# Altium project LED_Dimmer_MOSFET_SSR.PrjPcb
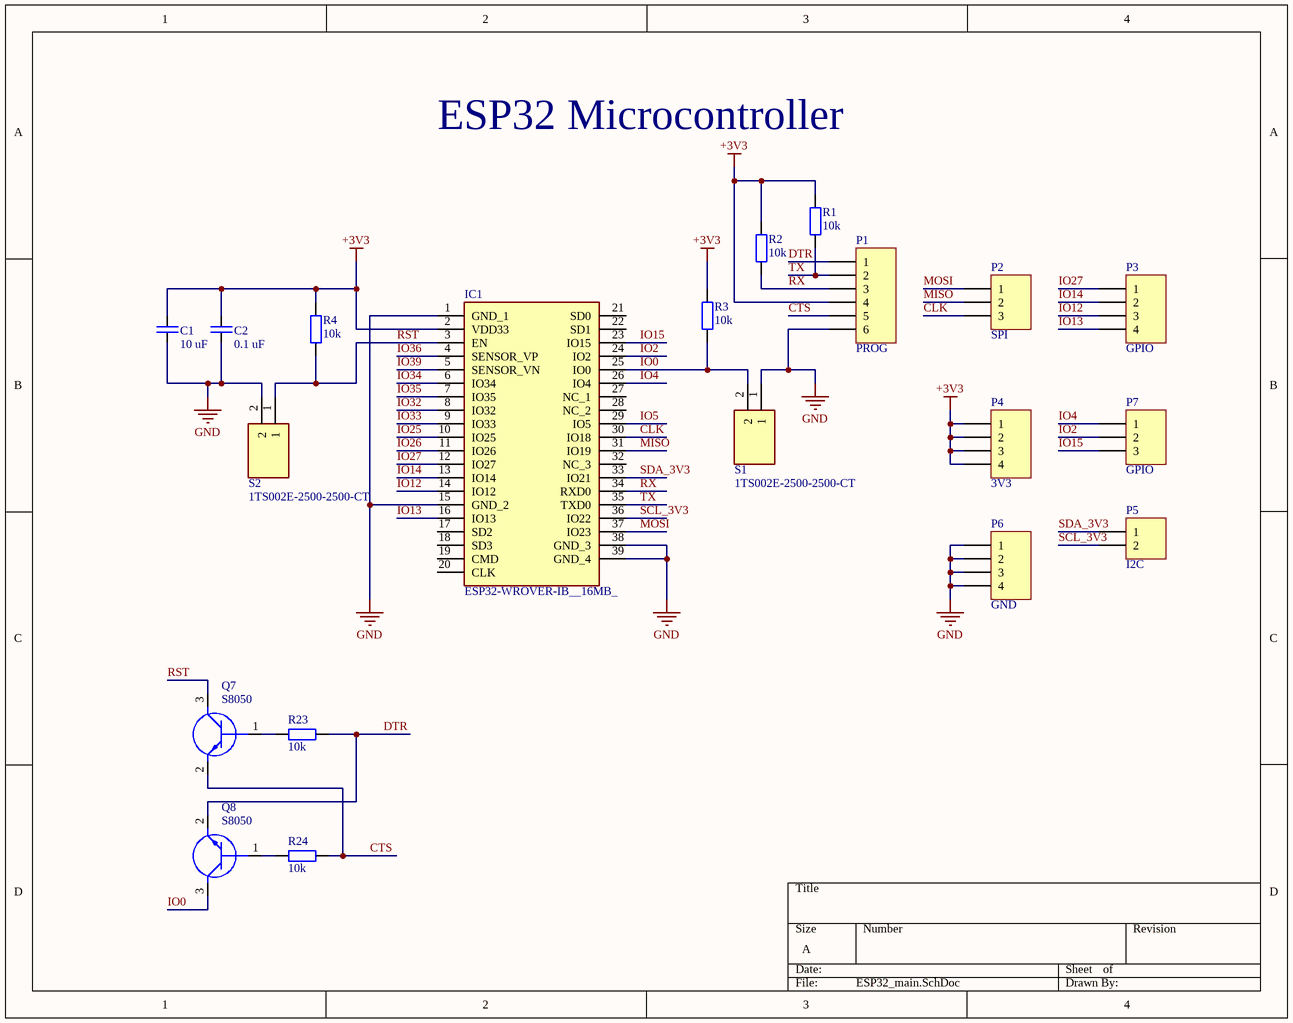
[diagram p0: ESP32_main.SchDoc]
3 sheets, 57 parts. Net scope: global (net labels, ports and power ports of the same name join across sheets).
Board files: LED_Dimmer_MOSFET_SSR_v1.0.PcbDoc, LED_Dimmer_MOSFET_SSR_v1.1.PcbDoc
Sheets:
  ESP32_main.SchDoc
  Mosfet_SSR.SchDoc
  230V_Inputs.SchDoc

## Sheet ESP32_main.SchDoc
size A; SheetNumber: 1; SheetTotal: 3

### Parts
C1  10 uF  [C2012_0805I_N]
C2  0.1 uF  [C2012_0805I_N]
IC1  ESP32-WROVER-IB__16MB_  [ESP32WROVERIB16MB]
P1  PROG  [HDR1X6]
P2  SPI  [HDR1X3]
P3  GPIO  [HDR1X4]
P4  3V3  [HDR1X4]
P5  I2C  [HDR1X2]
P6  GND  [HDR1X4]
P7  GPIO  [HDR1X3]
Q7  S8050  [SOT95P240X110-3N]
Q8  S8050  [SOT95P240X110-3N]
R1  10k  [R2012_0805I_N]
R2  10k  [R2012_0805I_N]
R3  10k  [R2012_0805I_N]
R4  10k  [R2012_0805I_N]
R23  10k  [R2012_0805I_N]
R24  10k  [R2012_0805I_N]
S1  1TS002E-2500-2500-CT  [1TS002E25002500CT]
S2  1TS002E-2500-2500-CT  [1TS002E25002500CT]

### Nets
+3V3: C1.1 C2.1 IC1.2(VDD33) P1.4 P4.1 P4.2 P4.3 P4.4 R1.2 R2.2 R3.2 R4.2
GND: C1.2 C2.2 IC1.1(GND_1) IC1.15(GND_2) IC1.38(GND_3) IC1.39(GND_4) P1.6 P6.1 P6.2 P6.3 P6.4 S1.1 S2.2
CLK: IC1.30(IO18) P2.3
CTS: P1.5 Q7.2(E) R24.1
DTR: P1.1 Q8.2(E) R23.1
IO0: IC1.25(IO0) Q8.3(C) R3.1 S1.2
IO2: IC1.24(IO2) P7.2
IO4: IC1.26(IO4) P7.1
IO5: IC1.29(IO5)
IO12: IC1.14(IO12) P3.3
IO13: IC1.16(IO13) P3.4
IO14: IC1.13(IO14) P3.2
IO15: IC1.23(IO15) P7.3
IO25: IC1.10(IO25)
IO26: IC1.11(IO26)
IO27: IC1.12(IO27) P3.1
IO32: IC1.8(IO32)
IO33: IC1.9(IO33)
IO34: IC1.6(IO34)
IO35: IC1.7(IO35)
IO36: IC1.4(SENSOR_VP)
IO39: IC1.5(SENSOR_VN)
MISO: IC1.31(IO19) P2.2
MOSI: IC1.37(IO23) P2.1
RST: IC1.3(EN) Q7.3(C) R4.1 S2.1
RX: IC1.34(RXD0) P1.3 R2.1
SCL_3V3: IC1.36(IO22) P5.2
SDA_3V3: IC1.33(IO21) P5.1
TX: IC1.35(TXD0) P1.2 R1.1
NetQ7_1: Q7.1(B) R23.2
NetQ8_1: Q8.1(B) R24.2

Not connected (* = marked no-connect by the designer): IC1 17(SD2) 18(SD3) 19(CMD) 20(CLK) 21(SD0) 22(SD1) 27(NC_1) 28(NC_2) 32(NC_3)

### Notes on the sheet
- ESP32 Microcontroller

### Library data of the parts
C1 C2 = C: Capacitor
  C1: Value: 10 uF
  C2: Value: 0.1 uF
IC1 = ESP32-WROVER-IB__16MB_: Integrated Circuit; Manufacturer_Name: Espressif Systems; Manufacturer_Part_Number: ESP32-WROVER-IB (16MB); Datasheet Link: https://componentsearchengine.com/Datasheets/1/ESP32-WROVER-IB (16MB).pdf; Height: 3.4mm; Mouser Part Number: 356-ESP32WROIB(16MB); Mouser Price/Stock: https://www.mouser.co.uk/ProductDetail/Espressif-Systems/ESP32-WROVER-IB-16MB?qs=w%2Fv1CP2dgqoY4iJbr7cDFQ%3D%3D
P1 = Header 6: Header, 6-Pin; LatestRevisionDate: 17-Jul-2002; LatestRevisionNote: Re-released for DXP Platform.; Publisher: Altium Limited
P2 P7 = Header 3: Header, 3-Pin; LatestRevisionDate: 17-Jul-2002; LatestRevisionNote: Re-released for DXP Platform.; Publisher: Altium Limited
P3 P4 P6 = Header 4: Header, 4-Pin; LatestRevisionDate: 17-Jul-2002; LatestRevisionNote: Re-released for DXP Platform.; Publisher: Altium Limited
P5 = Header 2: Header, 2-Pin; LatestRevisionDate: 17-Jul-2002; LatestRevisionNote: Re-released for DXP Platform.; Publisher: Altium Limited
Q7 Q8 = S8050: Transistor BJT NPN; Manufacturer_Name: Galaxy; Manufacturer_Part_Number: S8050G; Height: 1.1mm
R1-R4 R23 R24 = R: Value: 10k
S1 S2 = 1TS002E-2500-2500-CT: Switch; Manufacturer_Name: HON YUAN; Datasheet Link: https://datasheet.lcsc.com/szlcsc/HYP-1TS002E-2500-2500_C329185.pdf; Height: 2.7mm; Manufacturer_Part_Number: 1TS002E-2500-2500-CT

## Sheet Mosfet_SSR.SchDoc
size A; SheetNumber: 2; SheetTotal: 3
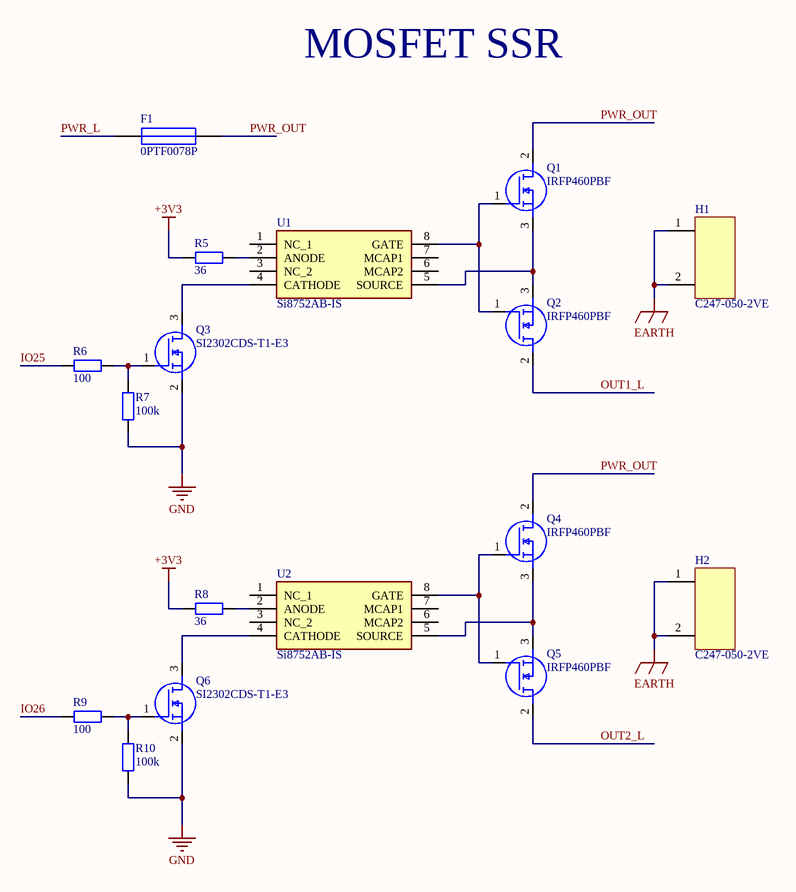
[diagram p1: Mosfet_SSR.SchDoc]

### Parts
F1  0PTF0078P  [FH1-200CK-B]
H1  C247-050-2VE  [C247-050-2VE]
H2  C247-050-2VE  [C247-050-2VE]
Q1  IRFP460PBF  [TO546P531X1558X2511-3P]
Q2  IRFP460PBF  [TO546P531X1558X2511-3P]
Q3  SI2302CDS-T1-E3  [SOT95P237X112-3N]
Q4  IRFP460PBF  [TO546P531X1558X2511-3P]
Q5  IRFP460PBF  [TO546P531X1558X2511-3P]
Q6  SI2302CDS-T1-E3  [SOT95P237X112-3N]
R5  36  [R2012_0805I_N]
R6  100  [R2012_0805I_N]
R7  100k  [R2012_0805I_N]
R8  36  [R2012_0805I_N]
R9  100  [R2012_0805I_N]
R10  100k  [R2012_0805I_N]
U1  Si8752AB-IS  [SOIC127P600X175-8N]
U2  Si8752AB-IS  [SOIC127P600X175-8N]

### Nets
+3V3: R5.2 R8.2
EARTH: H1.1 H1.2 H2.1 H2.2
GND: Q3.2(S) Q6.2(S) R7.1 R10.1
IO25: R6.2
IO26: R9.2
OUT1_L: Q2.2(D)
OUT2_L: Q5.2(D)
PWR_L: F1.1
PWR_OUT: F1.2 Q1.2(D) Q4.2(D)
NetQ1_1: Q1.1(G) Q2.1(G) U1.8(GATE)
NetQ1_3: Q1.3(S) Q2.3(S) U1.5(SOURCE)
NetQ3_1: Q3.1(G) R6.1 R7.2
NetQ3_3: Q3.3(D) U1.4(CATHODE)
NetQ4_1: Q4.1(G) Q5.1(G) U2.8(GATE)
NetQ4_3: Q4.3(S) Q5.3(S) U2.5(SOURCE)
NetQ6_1: Q6.1(G) R9.1 R10.2
NetQ6_3: Q6.3(D) U2.4(CATHODE)
NetR5_1: R5.1 U1.2(ANODE)
NetR8_1: R8.1 U2.2(ANODE)

Not connected (* = marked no-connect by the designer): U1 1(NC_1) 3(NC_2) 6(MCAP2) 7(MCAP1); U2 1(NC_1) 3(NC_2) 6(MCAP2) 7(MCAP1)

### Notes on the sheet
- MOSFET SSR

### Library data of the parts
F1 = 0PTF0078P: Fuse holder; Manufacturer_Name: LITTELFUSE; Datasheet Link: https://media.digikey.com/pdf/Data%20Sheets/Littelfuse%20PDFs/PTF075_77_78.pdf; Height: 11.5mm; Manufacturer_Part_Number: 0PTF0078P; Mouser Part Number: 576-0PTF0078P; Mouser Price/Stock: https://www.mouser.co.uk/ProductDetail/Littelfuse/0PTF0078P?qs=Co4VkB5J4%2Fsczy6gG8s%2FsA%3D%3D; Arrow Part Number: 0PTF0078P; Arrow Price/Stock: https://www.arrow.com/en/products/0ptf0078p/littelfuse?region=nac
H1 H2 = C247-050-2VE: Heatsink
Q1 Q2 Q4 Q5 = IRFP460PBF: MOSFET (N-Channel); Manufacturer_Name: Vishay; Datasheet Link: http://www.vishay.com/docs/91237/91237.pdf; Height: 5.31mm; Manufacturer_Part_Number: IRFP460PBF; Mouser Part Number: 844-IRFP460PBF; Mouser Price/Stock: https://www.mouser.co.uk/ProductDetail/Vishay-Semiconductors/IRFP460PBF?qs=%2FRKvNCQzLu1lHqVRTT%2Fu6Q%3D%3D; Arrow Part Number: IRFP460PBF; Arrow Price/Stock: https://www.arrow.com/en/products/irfp460pbf/vishay?region=nac
Q3 Q6 = SI2302CDS-T1-E3: MOSFET (N-Channel); Manufacturer_Name: Vishay; Datasheet Link: https://labcenter.componentsearchengine.com/Datasheets/2/SI2302CDS-T1-E3.pdf; Height: 1.12mm; Manufacturer_Part_Number: SI2302CDS-T1-E3; Mouser Part Number: 781-SI2302CDS-E3; Mouser Price/Stock: https://www.mouser.co.uk/ProductDetail/Vishay-Semiconductors/SI2302CDS-T1-E3?qs=%252BPu8jn5UVnHNrjAmGCs%2Fuw%3D%3D; Arrow Part Number: SI2302CDS-T1-E3; Arrow Price/Stock: https://www.arrow.com/en/products/si2302cds-t1-e3/vishay
R5-R10 = R
  R5 R8: Value: 36
  R6 R9: Value: 100
  R7 R10: Value: 100k
U1 U2 = Si8752AB-IS: Integrated Circuit; Manufacturer_Name: Silicon Labs; Datasheet Link: https://datasheet.datasheetarchive.com/originals/distributors/DKDS-19/378558.pdf; Height: 1.75mm; Manufacturer_Part_Number: Si8752AB-IS; Mouser Part Number: 634-SI8752AB-IS; Mouser Price/Stock: https://www.mouser.co.uk/ProductDetail/Silicon-Labs/SI8752AB-IS?qs=j6MGy4L9yX1nnSxizYyoBA%3D%3D; Arrow Part Number: SI8752AB-IS; Arrow Price/Stock: https://www.arrow.com/en/products/si8752ab-is/silicon-labs

## Sheet 230V_Inputs.SchDoc
size A; SheetNumber: 3; SheetTotal: 3
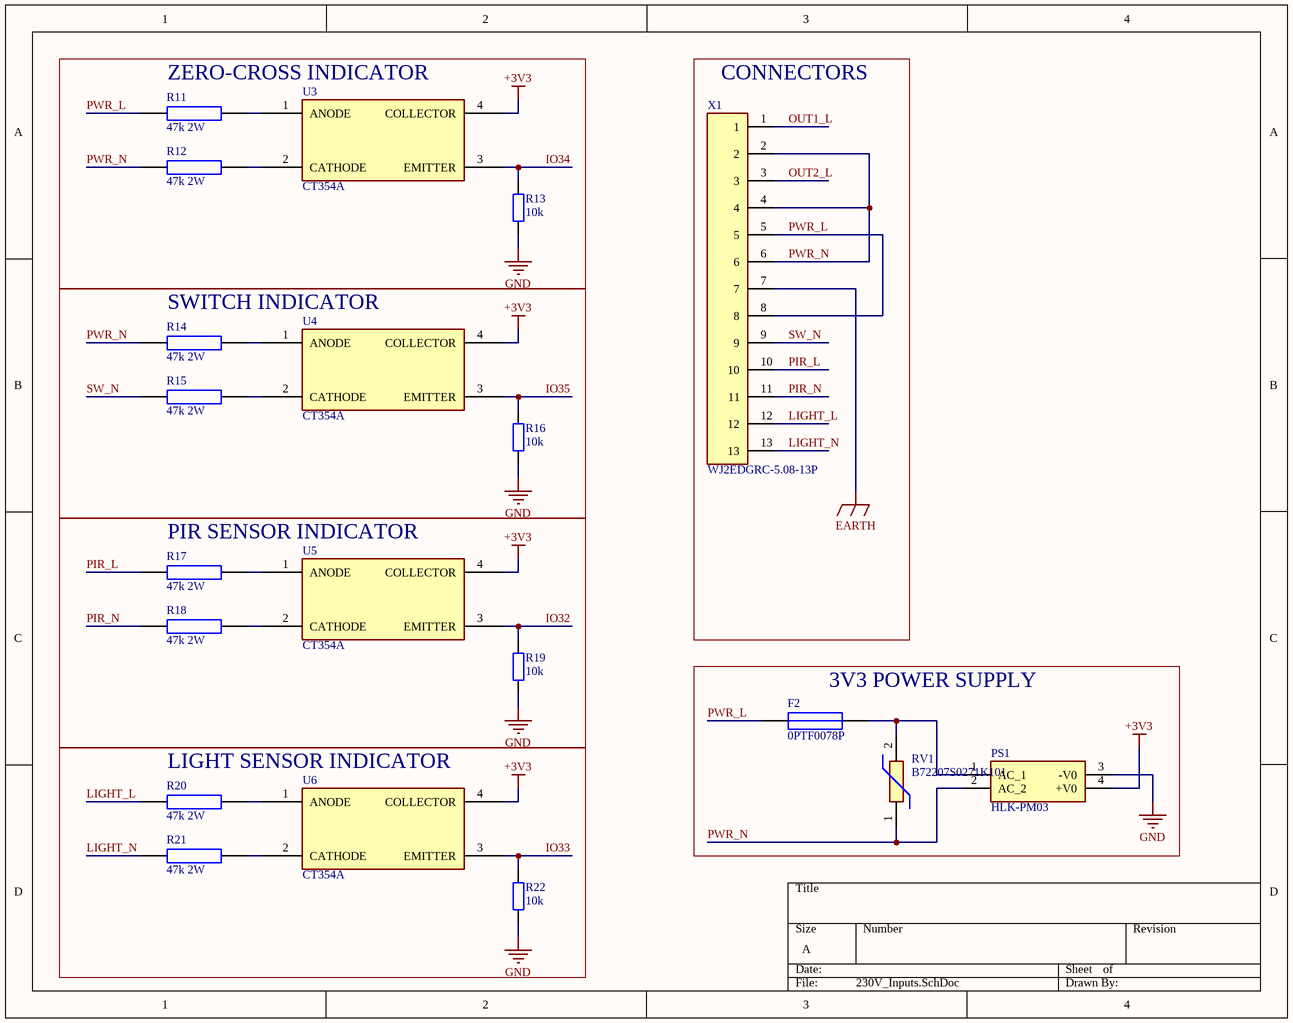
[diagram p2: 230V_Inputs.SchDoc]

### Parts
F2  0PTF0078P  [FH1-200CK-B]
PS1  HLK-PM03  [HLKPM03]
R11  47k 2W  [MFR02SF4702A10]
R12  47k 2W  [MFR02SF4702A10]
R13  10k  [R2012_0805I_N]
R14  47k 2W  [MFR02SF4702A10]
R15  47k 2W  [MFR02SF4702A10]
R16  10k  [R2012_0805I_N]
R17  47k 2W  [MFR02SF4702A10]
R18  47k 2W  [MFR02SF4702A10]
R19  10k  [R2012_0805I_N]
R20  47k 2W  [MFR02SF4702A10]
R21  47k 2W  [MFR02SF4702A10]
R22  10k  [R2012_0805I_N]
RV1  B72207S0271K101  [B72207S0271K101]
U3  CT354A  [CT354A]
U4  CT354A  [CT354A]
U5  CT354A  [CT354A]
U6  CT354A  [CT354A]
X1  WJ2EDGRC-5.08-13P  [WJ2EDGRC-5.08-13P_SLIM]

### Blocks framed on the sheet
ZERO-CROSS INDICATOR: R11-R13 U3
CONNECTORS: X1
SWITCH INDICATOR: R14-R16 U4
PIR SENSOR INDICATOR: R17-R19 U5
3V3 POWER SUPPLY: F2 PS1 RV1
LIGHT SENSOR INDICATOR: R20-R22 U6

### Nets
+3V3: PS1.4(+V0) U3.4(COLLECTOR) U4.4(COLLECTOR) U5.4(COLLECTOR) U6.4(COLLECTOR)
EARTH: X1.7
GND: PS1.3(-V0) R13.1 R16.1 R19.1 R22.1
IO32: R19.2 U5.3(EMITTER)
IO33: R22.2 U6.3(EMITTER)
IO34: R13.2 U3.3(EMITTER)
IO35: R16.2 U4.3(EMITTER)
LIGHT_L: R20.1 X1.12
LIGHT_N: R21.1 X1.13
OUT1_L: X1.1
OUT2_L: X1.3
PIR_L: R17.1 X1.10
PIR_N: R18.1 X1.11
PWR_L: F2.1 R11.1 X1.5 X1.8
PWR_N: PS1.2(AC_2) R12.1 R14.1 RV1.1 X1.2 X1.4 X1.6
SW_N: R15.1 X1.9
NetF2_2: F2.2 PS1.1(AC_1) RV1.2
NetR11_2: R11.2 U3.1(ANODE)
NetR12_2: R12.2 U3.2(CATHODE)
NetR14_2: R14.2 U4.1(ANODE)
NetR15_2: R15.2 U4.2(CATHODE)
NetR17_2: R17.2 U5.1(ANODE)
NetR18_2: R18.2 U5.2(CATHODE)
NetR20_2: R20.2 U6.1(ANODE)
NetR21_2: R21.2 U6.2(CATHODE)

### Library data of the parts
F2 = 0PTF0078P: as F1 on sheet Mosfet_SSR; Datasheet Link: https://media.digikey.com/pdf/Data%20Sheets/Littelfuse%20PDFs/PTF075_77_78.pdf; Height: 11.5mm; Manufacturer_Part_Number: 0PTF0078P; Mouser Part Number: 576-0PTF0078P; Mouser Price/Stock: https://www.mouser.co.uk/ProductDetail/Littelfuse/0PTF0078P?qs=Co4VkB5J4%2Fsczy6gG8s%2FsA%3D%3D; Arrow Part Number: 0PTF0078P; Arrow Price/Stock: https://www.arrow.com/en/products/0ptf0078p/littelfuse?region=nac
PS1 = HLK-PM03: Power Supply; Manufacturer_Name: Hi-Link; Datasheet Link: https://datasheet.lcsc.com/szlcsc/1906201102_HI-LINK-HLK-PM03_C209904.pdf; Height: 15mm; Manufacturer_Part_Number: HLK-PM03
R11 R12 R14 R15 R17 R18 R20 R21 = 47k 2W resistor: MFR02SF4702A10
R13 R16 R19 R22 = R: Value: 10k
RV1 = B72207S0271K101: Varistor; Manufacturer_Name: TDK; Datasheet Link: https://product.tdk.com/system/files/dam/doc/product/protection/voltage/lead-disk-varistor/data_sheet/70/db/var/siov_leaded_standard.pdf; Height: 11mm; Manufacturer_Part_Number: B72207S0271K101; Mouser Part Number: 871-B72207S271K101; Mouser Price/Stock: https://www.mouser.co.uk/ProductDetail/EPCOS-TDK/B72207S0271K101?qs=dEfas%2FXlABKLl07P%2FsKndA%3D%3D; Arrow Part Number: B72207S0271K101; Arrow Price/Stock: https://www.arrow.com/en/products/b72207s0271k101/epcos-tdk
X1 = WJ2EDGRC-5.08-13P: 13P 5.08 mm female socket connector

## Nets that join several sheets
+3V3: ESP32_main (12 pins), Mosfet_SSR (R5.2 R8.2), 230V_Inputs (5 pins)
EARTH: Mosfet_SSR (H1.1 H1.2 H2.1 H2.2), 230V_Inputs (X1.7)
GND: ESP32_main (13 pins), Mosfet_SSR (Q3.2 Q6.2 R7.1 R10.1), 230V_Inputs (5 pins)
IO25: ESP32_main (IC1.10), Mosfet_SSR (R6.2)
IO26: ESP32_main (IC1.11), Mosfet_SSR (R9.2)
IO32: ESP32_main (IC1.8), 230V_Inputs (R19.2 U5.3)
IO33: ESP32_main (IC1.9), 230V_Inputs (R22.2 U6.3)
IO34: ESP32_main (IC1.6), 230V_Inputs (R13.2 U3.3)
IO35: ESP32_main (IC1.7), 230V_Inputs (R16.2 U4.3)
OUT1_L: Mosfet_SSR (Q2.2), 230V_Inputs (X1.1)
OUT2_L: Mosfet_SSR (Q5.2), 230V_Inputs (X1.3)
PWR_L: Mosfet_SSR (F1.1), 230V_Inputs (F2.1 R11.1 X1.5 X1.8)